# Altium schematic sheet DE-020224_02.SchDoc: Modul sobe
size A3; Author: eldar6776@hotmail.com; DrawnBy: Eldar Dedic; Organization: I-MEDIA d.o.o. Sarajevo; Address1: Osman Topal Paše 18; Address2: 71000 Sarajevo; Address3: Federacija BiH; Address4: Bosna i Hercegovina; DocumentNumber: DE-200216; Revision: 278; SheetNumber: 2; SheetTotal: 2; ProjectName: DE-200216
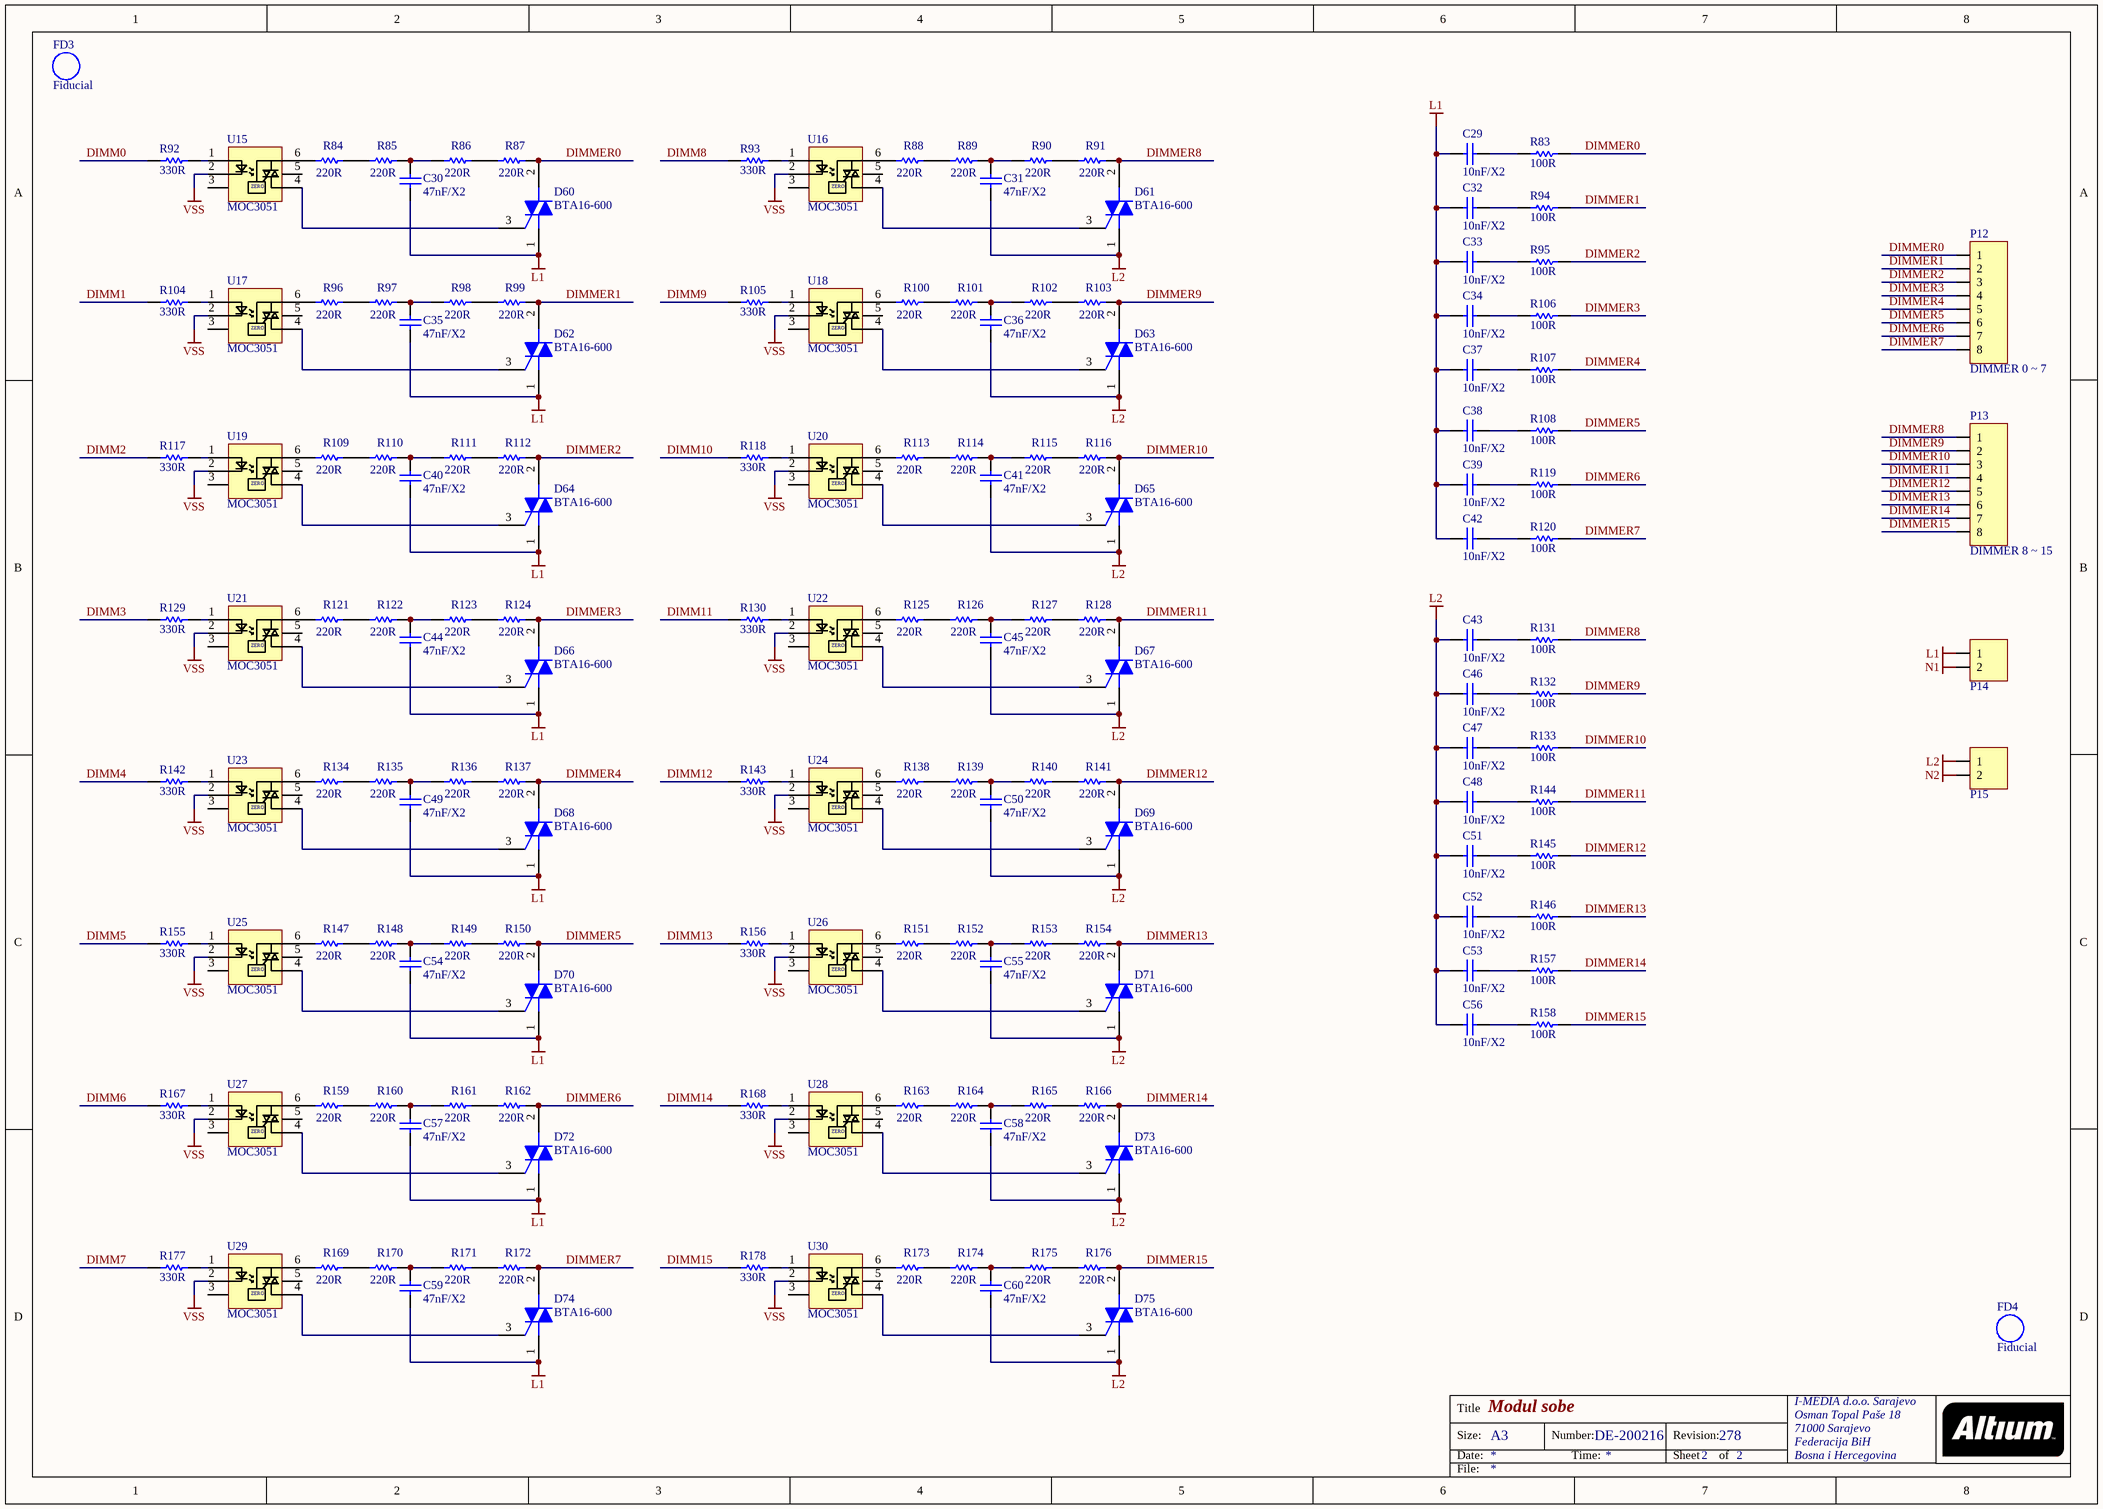
[diagram p0: DE-020224_02.SchDoc]

## Parts
C29  10nF/X2  [VP52-2.5]
C30  47nF/X2  [VP52-2.5]
C31  47nF/X2  [VP52-2.5]
C32  10nF/X2  [VP52-2.5]
C33  10nF/X2  [VP52-2.5]
C34  10nF/X2  [VP52-2.5]
C35  47nF/X2  [VP52-2.5]
C36  47nF/X2  [VP52-2.5]
C37  10nF/X2  [VP52-2.5]
C38  10nF/X2  [VP52-2.5]
C39  10nF/X2  [VP52-2.5]
C40  47nF/X2  [VP52-2.5]
C41  47nF/X2  [VP52-2.5]
C42  10nF/X2  [VP52-2.5]
C43  10nF/X2  [VP52-2.5]
C44  47nF/X2  [VP52-2.5]
C45  47nF/X2  [VP52-2.5]
C46  10nF/X2  [VP52-2.5]
C47  10nF/X2  [VP52-2.5]
C48  10nF/X2  [VP52-2.5]
C49  47nF/X2  [VP52-2.5]
C50  47nF/X2  [VP52-2.5]
C51  10nF/X2  [VP52-2.5]
C52  10nF/X2  [VP52-2.5]
C53  10nF/X2  [VP52-2.5]
C54  47nF/X2  [VP52-2.5]
C55  47nF/X2  [VP52-2.5]
C56  10nF/X2  [VP52-2.5]
C57  47nF/X2  [VP52-2.5]
C58  47nF/X2  [VP52-2.5]
C59  47nF/X2  [VP52-2.5]
C60  47nF/X2  [VP52-2.5]
D60  BTA16-600  [ONSC-TO-220-3-221A-07]
D61  BTA16-600  [ONSC-TO-220-3-221A-07]
D62  BTA16-600  [ONSC-TO-220-3-221A-07]
D63  BTA16-600  [ONSC-TO-220-3-221A-07]
D64  BTA16-600  [ONSC-TO-220-3-221A-07]
D65  BTA16-600  [ONSC-TO-220-3-221A-07]
D66  BTA16-600  [ONSC-TO-220-3-221A-07]
D67  BTA16-600  [ONSC-TO-220-3-221A-07]
D68  BTA16-600  [ONSC-TO-220-3-221A-07]
D69  BTA16-600  [ONSC-TO-220-3-221A-07]
D70  BTA16-600  [ONSC-TO-220-3-221A-07]
D71  BTA16-600  [ONSC-TO-220-3-221A-07]
D72  BTA16-600  [ONSC-TO-220-3-221A-07]
D73  BTA16-600  [ONSC-TO-220-3-221A-07]
D74  BTA16-600  [ONSC-TO-220-3-221A-07]
D75  BTA16-600  [ONSC-TO-220-3-221A-07]
FD3  Fiducial  [Fiducial]  (no BOM)
FD4  Fiducial  [Fiducial]  (no BOM)
P12  DIMMER 0 ~ 7  [TERMINAL BLOK 8]
P13  DIMMER 8 ~ 15  [TERMINAL BLOK 8]
P14  TERMINAL BLOK 2  [TERMINAL BLOK 2]  (value not drawn)
P15  TERMINAL BLOK 2  [TERMINAL BLOK 2]  (value not drawn)
R83  100R  [R6.35x2.3]
R84  220R  [ERA-0805]
R85  220R  [ERA-0805]
R86  220R  [ERA-0805]
R87  220R  [ERA-0805]
R88  220R  [ERA-0805]
R89  220R  [ERA-0805]
R90  220R  [ERA-0805]
R91  220R  [ERA-0805]
R92  330R  [ERA-0603]
R93  330R  [ERA-0603]
R94  100R  [R6.35x2.3]
R95  100R  [R6.35x2.3]
R96  220R  [ERA-0805]
R97  220R  [ERA-0805]
R98  220R  [ERA-0805]
R99  220R  [ERA-0805]
R100  220R  [ERA-0805]
R101  220R  [ERA-0805]
R102  220R  [ERA-0805]
R103  220R  [ERA-0805]
R104  330R  [ERA-0603]
R105  330R  [ERA-0603]
R106  100R  [R6.35x2.3]
R107  100R  [R6.35x2.3]
R108  100R  [R6.35x2.3]
R109  220R  [ERA-0805]
R110  220R  [ERA-0805]
R111  220R  [ERA-0805]
R112  220R  [ERA-0805]
R113  220R  [ERA-0805]
R114  220R  [ERA-0805]
R115  220R  [ERA-0805]
R116  220R  [ERA-0805]
R117  330R  [ERA-0603]
R118  330R  [ERA-0603]
R119  100R  [R6.35x2.3]
R120  100R  [R6.35x2.3]
R121  220R  [ERA-0805]
R122  220R  [ERA-0805]
R123  220R  [ERA-0805]
R124  220R  [ERA-0805]
R125  220R  [ERA-0805]
R126  220R  [ERA-0805]
R127  220R  [ERA-0805]
R128  220R  [ERA-0805]
R129  330R  [ERA-0603]
R130  330R  [ERA-0603]
R131  100R  [R6.35x2.3]
R132  100R  [R6.35x2.3]
R133  100R  [R6.35x2.3]
R134  220R  [ERA-0805]
R135  220R  [ERA-0805]
R136  220R  [ERA-0805]
R137  220R  [ERA-0805]
R138  220R  [ERA-0805]
R139  220R  [ERA-0805]
R140  220R  [ERA-0805]
R141  220R  [ERA-0805]
R142  330R  [ERA-0603]
R143  330R  [ERA-0603]
R144  100R  [R6.35x2.3]
R145  100R  [R6.35x2.3]
R146  100R  [R6.35x2.3]
R147  220R  [ERA-0805]
R148  220R  [ERA-0805]
R149  220R  [ERA-0805]
R150  220R  [ERA-0805]
R151  220R  [ERA-0805]
R152  220R  [ERA-0805]
R153  220R  [ERA-0805]
R154  220R  [ERA-0805]
R155  330R  [ERA-0603]
R156  330R  [ERA-0603]
R157  100R  [R6.35x2.3]
R158  100R  [R6.35x2.3]
R159  220R  [ERA-0805]
R160  220R  [ERA-0805]
R161  220R  [ERA-0805]
R162  220R  [ERA-0805]
R163  220R  [ERA-0805]
R164  220R  [ERA-0805]
R165  220R  [ERA-0805]
R166  220R  [ERA-0805]
R167  330R  [ERA-0603]
R168  330R  [ERA-0603]
R169  220R  [ERA-0805]
R170  220R  [ERA-0805]
R171  220R  [ERA-0805]
R172  220R  [ERA-0805]
R173  220R  [ERA-0805]
R174  220R  [ERA-0805]
R175  220R  [ERA-0805]
R176  220R  [ERA-0805]
R177  330R  [ERA-0603]
R178  330R  [ERA-0603]
U15  MOC3051  [DIP6]
U16  MOC3051  [DIP6]
U17  MOC3051  [DIP6]
U18  MOC3051  [DIP6]
U19  MOC3051  [DIP6]
U20  MOC3051  [DIP6]
U21  MOC3051  [DIP6]
U22  MOC3051  [DIP6]
U23  MOC3051  [DIP6]
U24  MOC3051  [DIP6]
U25  MOC3051  [DIP6]
U26  MOC3051  [DIP6]
U27  MOC3051  [DIP6]
U28  MOC3051  [DIP6]
U29  MOC3051  [DIP6]
U30  MOC3051  [DIP6]

## Nets
L1: C29.2 C30.1 C32.2 C33.2 C34.2 C35.1 C37.2 C38.2 C39.2 C40.1 C42.2 C44.1 C49.1 C54.1 C57.1 C59.1 D60.1(MT1) D62.1(MT1) D64.1(MT1) D66.1(MT1) D68.1(MT1) D70.1(MT1) D72.1(MT1) D74.1(MT1) P14.1
L2: C31.1 C36.1 C41.1 C43.2 C45.1 C46.2 C47.2 C48.2 C50.1 C51.2 C52.2 C53.2 C55.1 C56.2 C58.1 C60.1 D61.1(MT1) D63.1(MT1) D65.1(MT1) D67.1(MT1) D69.1(MT1) D71.1(MT1) D73.1(MT1) D75.1(MT1) P15.1
N1: P14.2
N2: P15.2
VSS: U15.2 U16.2 U17.2 U18.2 U19.2 U20.2 U21.2 U22.2 U23.2 U24.2 U25.2 U26.2 U27.2 U28.2 U29.2 U30.2
DIMM0: R92.1
DIMM1: R104.1
DIMM2: R117.1
DIMM3: R129.1
DIMM4: R142.1
DIMM5: R155.1
DIMM6: R167.1
DIMM7: R177.1
DIMM8: R93.1
DIMM9: R105.1
DIMM10: R118.1
DIMM11: R130.1
DIMM12: R143.1
DIMM13: R156.1
DIMM14: R168.1
DIMM15: R178.1
DIMMER0: D60.2(MT2) P12.1 R83.1 R87.2
DIMMER1: D62.2(MT2) P12.2 R94.1 R99.2
DIMMER2: D64.2(MT2) P12.3 R95.1 R112.2
DIMMER3: D66.2(MT2) P12.4 R106.1 R124.2
DIMMER4: D68.2(MT2) P12.5 R107.1 R137.2
DIMMER5: D70.2(MT2) P12.6 R108.1 R150.2
DIMMER6: D72.2(MT2) P12.7 R119.1 R162.2
DIMMER7: D74.2(MT2) P12.8 R120.1 R172.2
DIMMER8: D61.2(MT2) P13.1 R91.2 R131.1
DIMMER9: D63.2(MT2) P13.2 R103.2 R132.1
DIMMER10: D65.2(MT2) P13.3 R116.2 R133.1
DIMMER11: D67.2(MT2) P13.4 R128.2 R144.1
DIMMER12: D69.2(MT2) P13.5 R141.2 R145.1
DIMMER13: D71.2(MT2) P13.6 R146.1 R154.2
DIMMER14: D73.2(MT2) P13.7 R157.1 R166.2
DIMMER15: D75.2(MT2) P13.8 R158.1 R176.2
NetC29_1: C29.1 R83.2
NetC30_2: C30.2 R85.2 R86.1
NetC31_2: C31.2 R89.2 R90.1
NetC32_1: C32.1 R94.2
NetC33_1: C33.1 R95.2
NetC34_1: C34.1 R106.2
NetC35_2: C35.2 R97.2 R98.1
NetC36_2: C36.2 R101.2 R102.1
NetC37_1: C37.1 R107.2
NetC38_1: C38.1 R108.2
NetC39_1: C39.1 R119.2
NetC40_2: C40.2 R110.2 R111.1
NetC41_2: C41.2 R114.2 R115.1
NetC42_1: C42.1 R120.2
NetC43_1: C43.1 R131.2
NetC44_2: C44.2 R122.2 R123.1
NetC45_2: C45.2 R126.2 R127.1
NetC46_1: C46.1 R132.2
NetC47_1: C47.1 R133.2
NetC48_1: C48.1 R144.2
NetC49_2: C49.2 R135.2 R136.1
NetC50_2: C50.2 R139.2 R140.1
NetC51_1: C51.1 R145.2
NetC52_1: C52.1 R146.2
NetC53_1: C53.1 R157.2
NetC54_2: C54.2 R148.2 R149.1
NetC55_2: C55.2 R152.2 R153.1
NetC56_1: C56.1 R158.2
NetC57_2: C57.2 R160.2 R161.1
NetC58_2: C58.2 R164.2 R165.1
NetC59_2: C59.2 R170.2 R171.1
NetC60_2: C60.2 R174.2 R175.1
NetD60_3: D60.3(G) U15.4
NetD61_3: D61.3(G) U16.4
NetD62_3: D62.3(G) U17.4
NetD63_3: D63.3(G) U18.4
NetD64_3: D64.3(G) U19.4
NetD65_3: D65.3(G) U20.4
NetD66_3: D66.3(G) U21.4
NetD67_3: D67.3(G) U22.4
NetD68_3: D68.3(G) U23.4
NetD69_3: D69.3(G) U24.4
NetD70_3: D70.3(G) U25.4
NetD71_3: D71.3(G) U26.4
NetD72_3: D72.3(G) U27.4
NetD73_3: D73.3(G) U28.4
NetD74_3: D74.3(G) U29.4
NetD75_3: D75.3(G) U30.4
NetR84_1: R84.1 U15.6
NetR84_2: R84.2 R85.1
NetR86_2: R86.2 R87.1
NetR88_1: R88.1 U16.6
NetR88_2: R88.2 R89.1
NetR90_2: R90.2 R91.1
NetR92_2: R92.2 U15.1
NetR93_2: R93.2 U16.1
NetR96_1: R96.1 U17.6
NetR96_2: R96.2 R97.1
NetR98_2: R98.2 R99.1
NetR100_1: R100.1 U18.6
NetR100_2: R100.2 R101.1
NetR102_2: R102.2 R103.1
NetR104_2: R104.2 U17.1
NetR105_2: R105.2 U18.1
NetR109_1: R109.1 U19.6
NetR109_2: R109.2 R110.1
NetR111_2: R111.2 R112.1
NetR113_1: R113.1 U20.6
NetR113_2: R113.2 R114.1
NetR115_2: R115.2 R116.1
NetR117_2: R117.2 U19.1
NetR118_2: R118.2 U20.1
NetR121_1: R121.1 U21.6
NetR121_2: R121.2 R122.1
NetR123_2: R123.2 R124.1
NetR125_1: R125.1 U22.6
NetR125_2: R125.2 R126.1
NetR127_2: R127.2 R128.1
NetR129_2: R129.2 U21.1
NetR130_2: R130.2 U22.1
NetR134_1: R134.1 U23.6
NetR134_2: R134.2 R135.1
NetR136_2: R136.2 R137.1
NetR138_1: R138.1 U24.6
NetR138_2: R138.2 R139.1
NetR140_2: R140.2 R141.1
NetR142_2: R142.2 U23.1
NetR143_2: R143.2 U24.1
NetR147_1: R147.1 U25.6
NetR147_2: R147.2 R148.1
NetR149_2: R149.2 R150.1
NetR151_1: R151.1 U26.6
NetR151_2: R151.2 R152.1
NetR153_2: R153.2 R154.1
NetR155_2: R155.2 U25.1
NetR156_2: R156.2 U26.1
NetR159_1: R159.1 U27.6
NetR159_2: R159.2 R160.1
NetR161_2: R161.2 R162.1
NetR163_1: R163.1 U28.6
NetR163_2: R163.2 R164.1
NetR165_2: R165.2 R166.1
NetR167_2: R167.2 U27.1
NetR168_2: R168.2 U28.1
NetR169_1: R169.1 U29.6
NetR169_2: R169.2 R170.1
NetR171_2: R171.2 R172.1
NetR173_1: R173.1 U30.6
NetR173_2: R173.2 R174.1
NetR175_2: R175.2 R176.1
NetR177_2: R177.2 U29.1
NetR178_2: R178.2 U30.1

Not connected (* = marked no-connect by the designer): U15 3 5; U16 3 5; U17 3 5; U18 3 5; U19 3 5; U20 3 5; U21 3 5; U22 3 5; U23 3 5; U24 3 5; U25 3 5; U26 3 5; U27 3 5; U28 3 5; U29 3 5; U30 3 5

## Notes on the sheet
- Title
- Size:
- Date:
- A3
- Number:
- Time:
- Revision:
- Sheet
- of
- File:
- (in symbol MOC3081) ZERO

## Library data of the parts
C29-C60 = VP52BA103: Dipped Radial Multilayer Ceramic Capacitor COG (NPO): 10nF; Note: See Datasheet for other packages & tolerances; Published: 17-Dec-2003; DatasheetDocument: 2-Jan-2002; PackageDocument: 8-Feb-2002; PackageReference: VP52-2.5; Publisher: Altium Limited; ComponentLink1Description: Manufacturer Link; ComponentLink1URL: http://www.vishay.com/; Value: 10nF
D60-D75 = BTA08-600BW3G: Triacs, Silicon Bidirectional Thyristor, 3-Pin TO-220, Pb-Free, Tube; Manufacturer: On Semiconductor; IGT Max (mA): 50; IT(RMS) Max (A): 8; ITSM Max (A): 90; DatasheetVersion: Rev. 1; PackageVersion: Rev. O, 07/2008; PackageReference: TO-220-3-221A-07; PackageDescription: 3-Pin Flange Mount, Vertical Straight Lead, Body 9.97 x 4.445 mm, Pitch 2.54 mm; Supplier 1: Digi-Key; Supplier Part Number 1: BTA08-600BW3G-ND; Supplier 2: Newark; Supplier Part Number 2: 13P2072; Supplier 3: Mouser; Supplier Part Number 3: 863-BTA08-600BW3G; Packing: Tube; RoHS: Pb-Free; Mounting Technology: Through Hole; PartNumber: BTA08-600BW3G; ComponentLink1Description: Manufacturer URL; ComponentLink1URL: http://www.onsemi.com/; ComponentLink2Description: Datasheet; ComponentLink2URL: http://www.onsemi.com/pub_link/Collateral/BTA08-600BW3-D.PDF; ComponentLink3Description: Package Specification; ComponentLink3URL: http://www.onsemi.com/pub_link/Collateral/221A-07.PDF
FD3 FD4 = Fiduchial: Fiduchial mark
P12 P13 = TERMINAL BLOK 8 MANJI: 8 pin terminal cable connector
P14 P15 = TERMINAL BLOK 2: 2 pinski terminal blok
R83 R94 R95 R106-R108 R119 R120 R131-R133 R144-R146 R157 R158 = ERG12: Metal Oxide Film Resistor, 0.1 Ohm to 47k Ohm Range, 2% and 5% Tolerance, 0.5 W; Published: 17-Dec-2003; PackageReference: R6.35x2.3; Publisher: Altium Limited; ComponentLink1Description: Manufacturer Link; ComponentLink1URL: http://www.panasonic.com/industrial/components/resistive_products.htm; ComponentLink2Description: Datasheet; ComponentLink2URL: http://www.panasonic.com/industrial/components/pdf/AOA0000CE18.pdf
R84-R91 R96-R103 R109-R116 R121-R128 R134-R141 R147-R154 R159-R166 R169-R176 = ERA6Y: Rectangular Thick Film Chip Resistor, 10 Ohm to 1M Ohm Range, 0.1% and 0.5% Tolerance, 0805 Size, 0.1 W; Note: If flow soldering, adjust pad width of PCB Footprint to 0.7 - 0.8 times the width of the resistor.; Published: 17-Dec-2003; LatestRevisionDate: 19-Mar-2004; LatestRevisionNote: Silkscreen size reduced.; PackageDocument: Mar-2003; PackageReference: ERA-0805; Publisher: Altium Limited; Code_IPC: 2012 [0805]; ComponentLink1Description: Manufacturer Link; ComponentLink1URL: http://www.panasonic.com/industrial/components/resistive_products.htm; ComponentLink2Description: Datasheet; ComponentLink2URL: http://www.panasonic.com/industrial/components/pdf/AOA0000CE8.pdf
R92 R93 R104 R105 R117 R118 R129 R130 R142 R143 R155 R156 R167 R168 R177 R178 = ERA3Y: Rectangular Thick Film Chip Resistor, 10 Ohm to 330k Ohm Range, 0.1% and 0.5% Tolerance, 0603 Size, 0.063 W; Note: If flow soldering, adjust pad width of PCB Footprint to 0.7 - 0.8 times the width of the resistor.; Published: 17-Dec-2003; LatestRevisionDate: 19-Mar-2004; LatestRevisionNote: Silkscreen size reduced.; PackageDocument: Mar-2003; PackageReference: ERA-0603; Publisher: Altium Limited; Code_IPC: 1608 [0603]; ComponentLink1Description: Manufacturer Link; ComponentLink1URL: http://www.panasonic.com/industrial/components/resistive_products.htm; ComponentLink2Description: Datasheet; ComponentLink2URL: http://www.panasonic.com/industrial/components/pdf/AOA0000CE8.pdf
U15-U30 = MOC3081: Zero-Cross Optoisolator Triac Driver